# Altium project LKS074DO_BRUSH_0406.PrjPcb
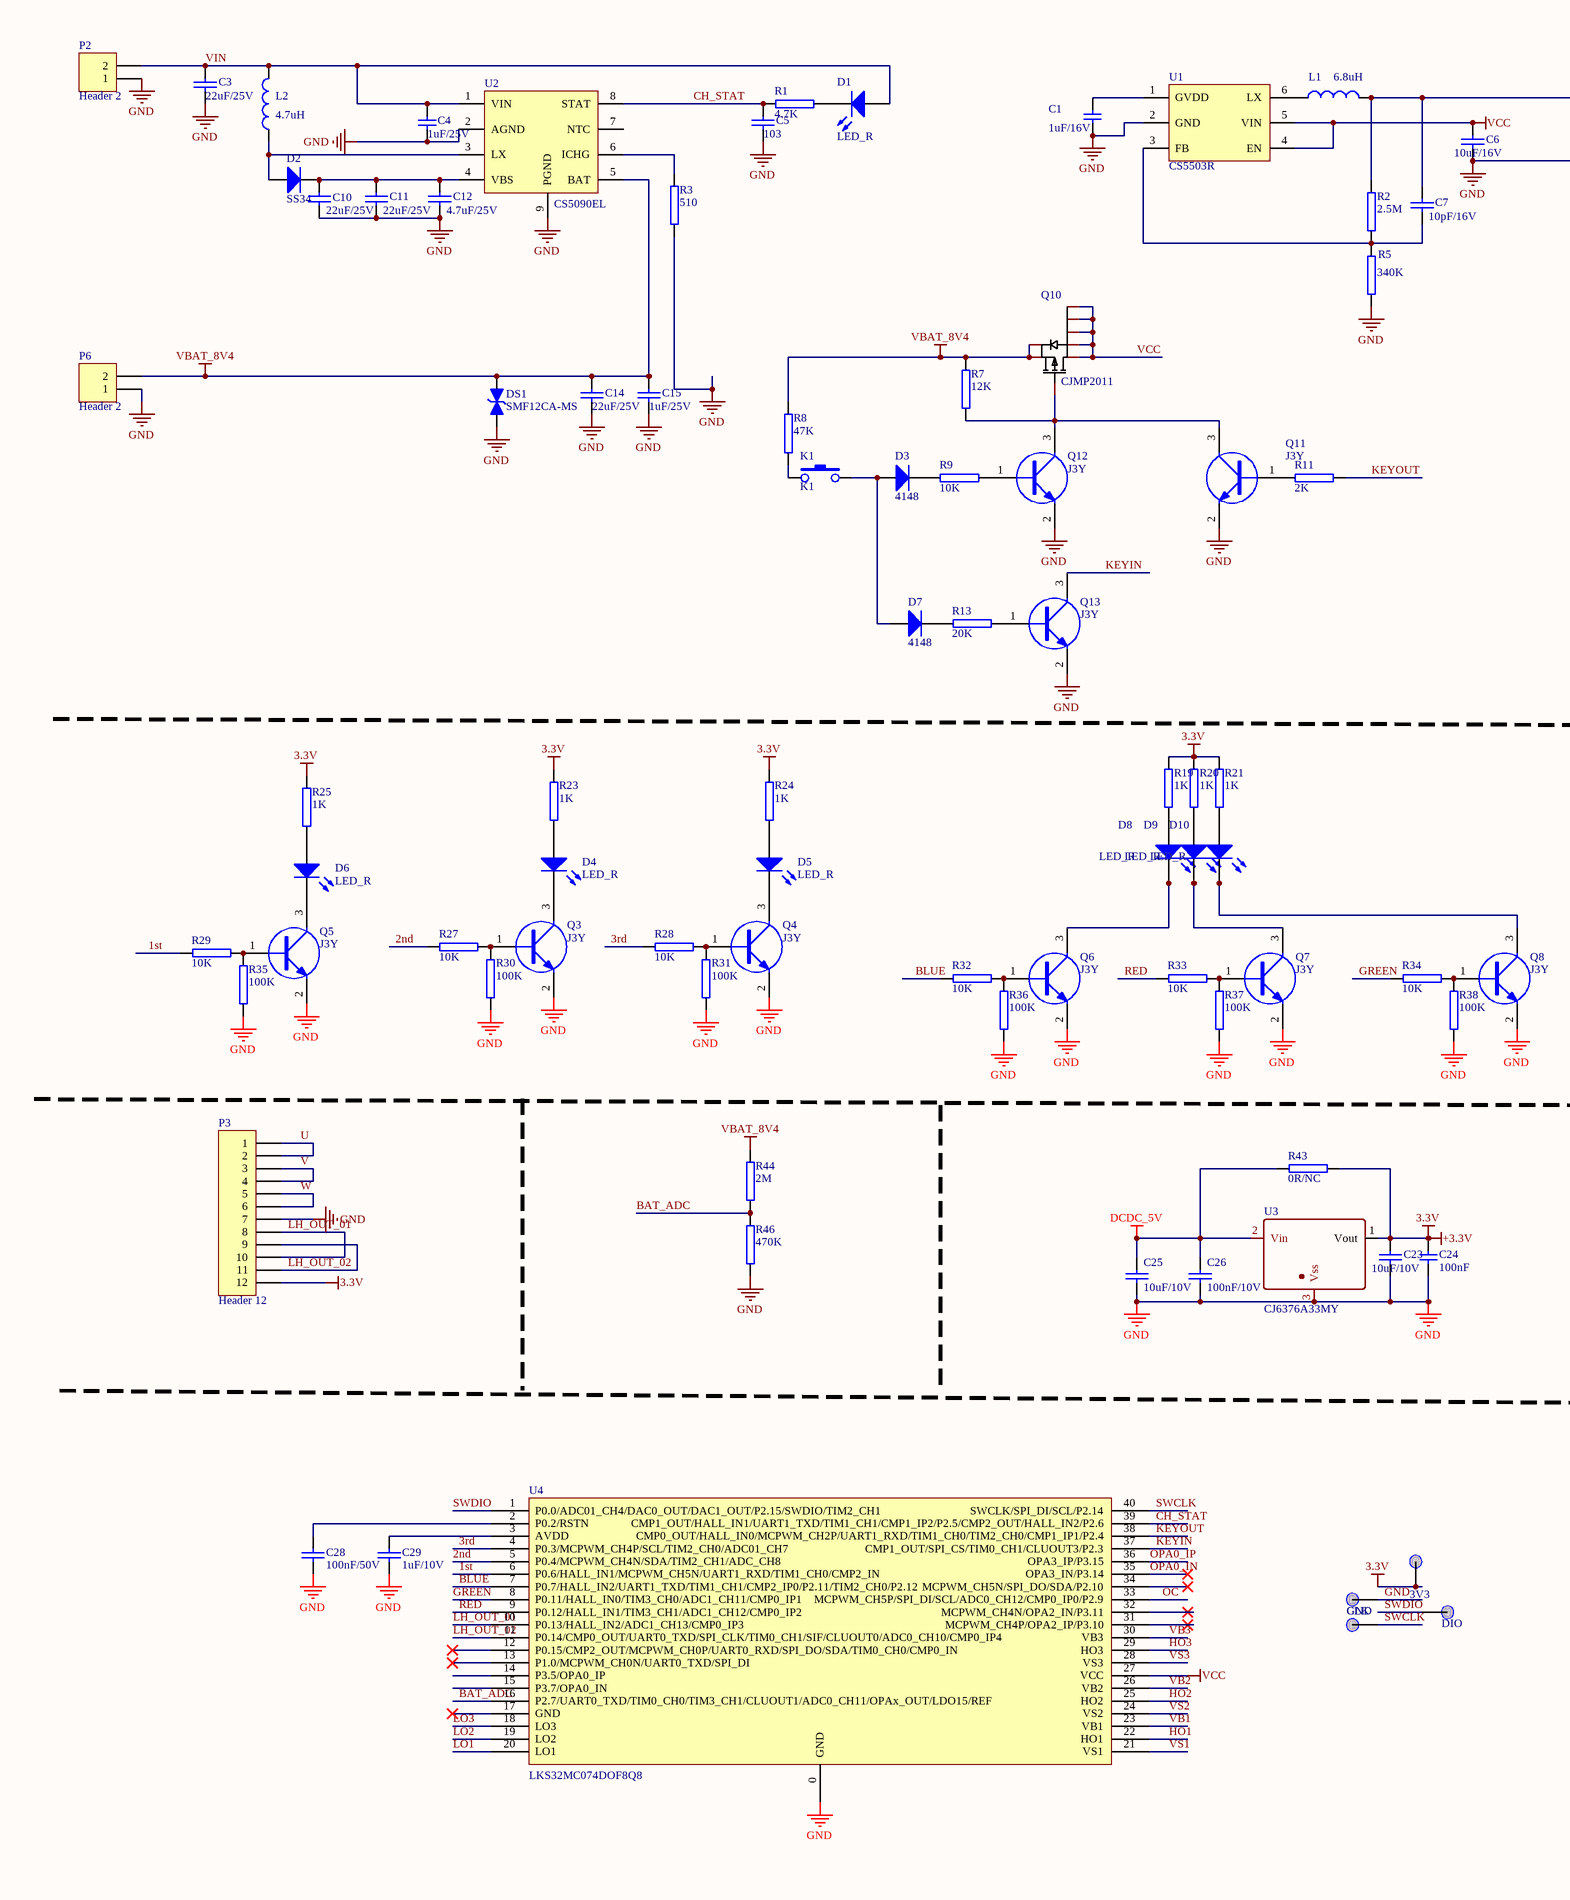
[diagram p0: LKS_074DO_0406.SchDoc, left]
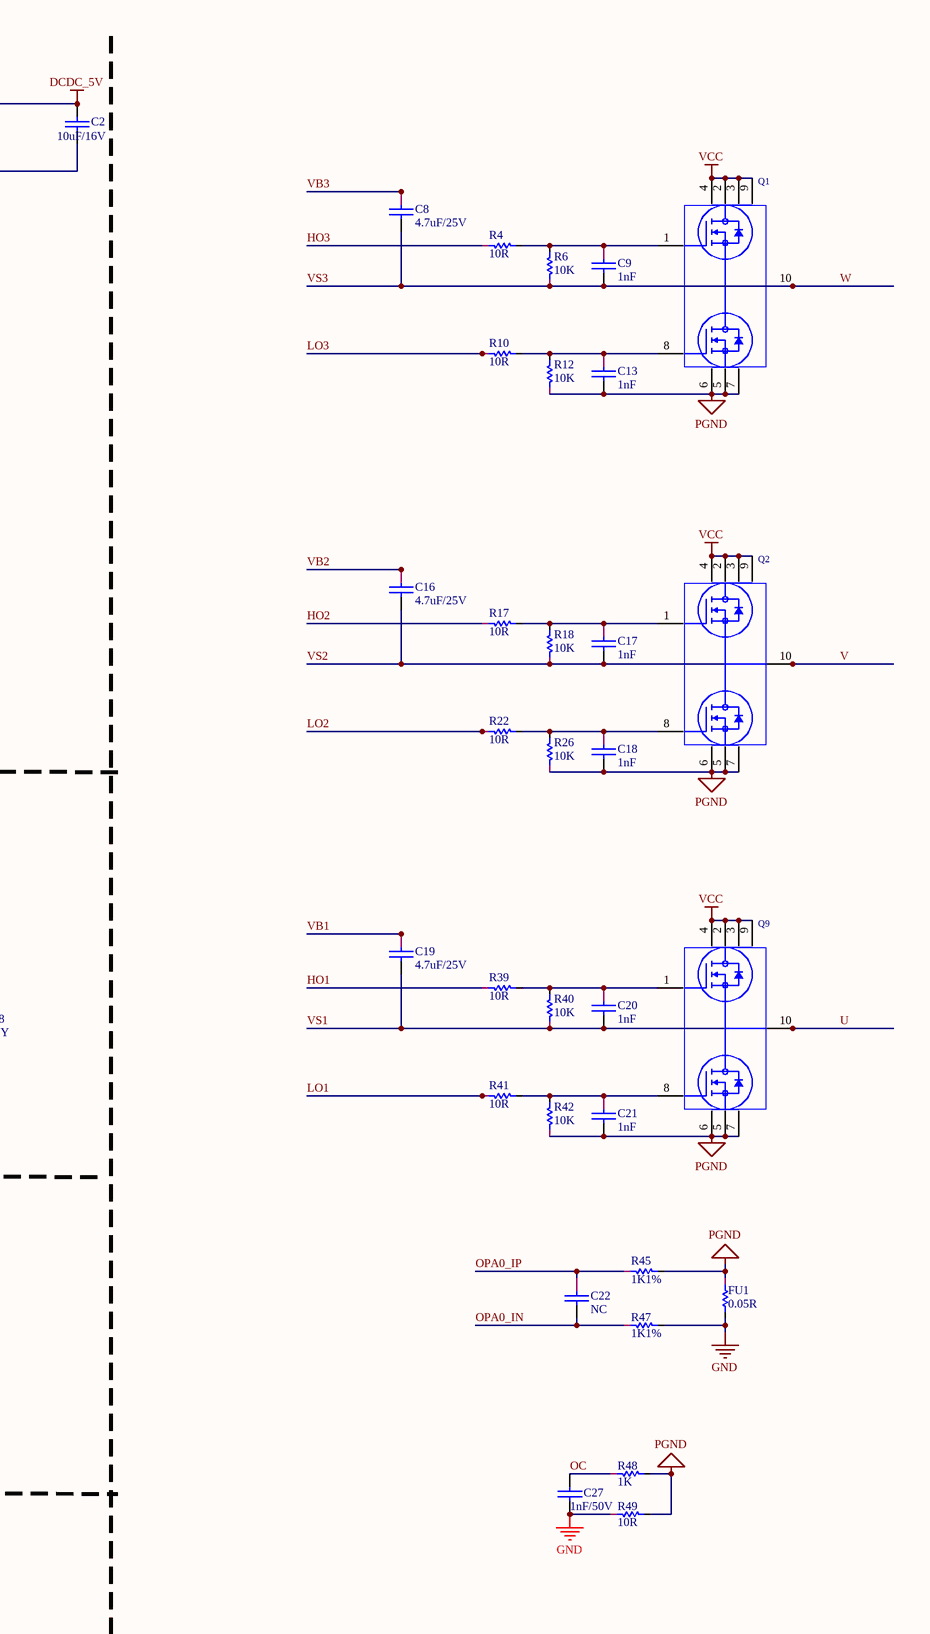
[diagram p1: LKS_074DO_0406.SchDoc, right]
1 sheet, 114 parts. Net scope: global (net labels, ports and power ports of the same name join across sheets).
Board file: LKS_Motor_0406.PcbDoc

## Sheet LKS_074DO_0406.SchDoc: LKS034DO_FOC_MOTOR
size C; Date: 20220518; DrawnBy: WPJ; Organization: PuXun Tech Co.Ltd.; Revision: V1.0; SheetNumber: 1; SheetTotal: 1; PageSetup: Record=PageOptions?CenterHorizontal=True?CenterVertical=True?PrintScale=0.54?XCorrection=1.00?YCorrection=1.00?PrintKind=0?BorderSize=5000000?LeftOffset=0?BottomOffset=0?Orientation=2?PaperLength=1000?PaperWidth=1000?Scale=100?PaperSource=7?PrintQuality=-4?MediaType=1?DitherType=10?PaperKind=A4?PrintScaleMode=1

### Parts
3V3  test  [piot]  (value not drawn)
C1  1uF/16V  [C 0402_M]
C2  10uF/16V  [C 0603_M]
C3  22uF/25V  [C 0603_M]
C4  1uF/25V  [C 0402_M]
C5  103  [R 0402_M]
C6  10uF/16V  [C 0603_M]
C7  10pF/16V  [C 0402_M]
C8  4.7uF/25V  [C 0402_M]
C9  1nF  [C 0402_M]
C10  22uF/25V  [C 0603_M]
C11  22uF/25V  [C 0603_M]
C12  4.7uF/25V  [C 0402_M]
C13  1nF  [C 0402_M]
C14  22uF/25V  [C 0603_M]
C15  1uF/25V  [C 0402_M]
C16  4.7uF/25V  [C 0402_M]
C17  1nF  [C 0402_M]
C18  1nF  [C 0402_M]
C19  4.7uF/25V  [C 0402_M]
C20  1nF  [C 0402_M]
C21  1nF  [C 0402_M]
C22  NC  [C 0402_M]
C23  10uF/10V  [C 0603_M]
C24  100nF  [C 0402_M]
C25  10uF/10V  [C 0603_M]
C26  100nF/10V  [C 0402_M]
C27  1nF/50V  [C 0402_M]
C28  100nF/50V  [C 0402_M]
C29  1uF/10V  [C 0402_M]
CLK  test  [piot]  (value not drawn)
D1  LED_R  [0603-LED]
D2  SS34  [SOD123FL]
D3  4148  [SOD-323]
D4  LED_R  [0603-LED]
D5  LED_R  [0603-LED]
D6  LED_R  [0603-LED]
D7  4148  [SOD-323]
D8  LED_R  [0603-LED]
D9  LED_R  [0603-LED]
D10  LED_R  [0603-LED]
DIO  test  [piot]  (value not drawn)
DS1  SMF12CA-MS  [SOD-123F]
FU1  0.05R  [R 0805_M]
GND  test  [piot]  (value not drawn)
K1  K1  [SMD3.3X3.3X2]
L1  6.8uH  [SMD3.5X3 .2- duplicate]
L2  4.7uH  [SMD3.5X3 .2- duplicate]
P2  Header 2  [CONN_SMD_2P_0.6]
P3  Header 12  [SMD-12]
P6  Header 2  [CONN_SMD_2P_0.6]
Q1  CJBM3020  [DFN-3X3_8]  (value not drawn)
Q2  CJBM3020  [DFN-3X3_8]  (value not drawn)
Q3  J3Y  [SOT-23]
Q4  J3Y  [SOT-23]
Q5  J3Y  [SOT-23]
Q6  J3Y  [SOT-23]
Q7  J3Y  [SOT-23]
Q8  J3Y  [SOT-23]
Q9  CJBM3020  [DFN-3X3_8]  (value not drawn)
Q10  CJMP2011  [DFN-6-2X2]
Q11  J3Y  [SOT-23]
Q12  J3Y  [SOT-23]
Q13  J3Y  [SOT-23]
R1  4.7K  [C 0402_M]
R2  2.5M  [C 0402_M]
R3  510  [R 0402_M]
R4  10R  [R 0402_M]
R5  340K  [C 0402_M]
R6  10K  [R 0402_M]
R7  12K  [C 0402_M]
R8  47K  [C 0402_M]
R9  10K  [C 0402_M]
R10  10R  [R 0402_M]
R11  2K  [C 0402_M]
R12  10K  [R 0402_M]
R13  20K  [C 0402_M]
R17  10R  [R 0402_M]
R18  10K  [R 0402_M]
R19  1K  [C 0402_M]
R20  1K  [C 0402_M]
R21  1K  [C 0402_M]
R22  10R  [R 0402_M]
R23  1K  [C 0402_M]
R24  1K  [C 0402_M]
R25  1K  [C 0402_M]
R26  10K  [R 0402_M]
R27  10K  [C 0402_M]
R28  10K  [C 0402_M]
R29  10K  [C 0402_M]
R30  100K  [C 0402_M]
R31  100K  [C 0402_M]
R32  10K  [C 0402_M]
R33  10K  [C 0402_M]
R34  10K  [C 0402_M]
R35  100K  [C 0402_M]
R36  100K  [C 0402_M]
R37  100K  [C 0402_M]
R38  100K  [C 0402_M]
R39  10R  [R 0402_M]
R40  10K  [R 0402_M]
R41  10R  [R 0402_M]
R42  10K  [R 0402_M]
R43  0R/NC  [0603]
R44  2M  [C 0402_M]
R45  1K1%  [R 0402_M]
R46  470K  [C 0402_M]
R47  1K1%  [R 0402_M]
R48  1K  [R 0402_M]
R49  10R  [R 0402_M]
U1  CS5503R  [SOT23-6L]
U2  CS5090EL  [DFN2X2_8_0.5]
U3  CJ6376A33MY  [SOT-23]
U4  LKS32MC074DOF8Q8  [QFN40]

### Nets
+3.3V: 3V3.1 C23.2 C24.1 P3.12 R19.2 R20.2 R21.2 R23.2 R24.2 R25.2 R43.2 U3.1(Vout)  [also labelled 3.3V]
DCDC_5V: C2.2 C7.2 C25.2 C26.1 L1.2 R2.1 R43.1 U3.2(Vin)
GND: C1.1 C2.1 C3.1 C4.2 C5.1 C6.1 C10.1 C11.1 C12.1 C14.1 C15.1 C23.1 C24.2 C25.1 C26.2 C27.1 C28.2 C29.1 DS1.2(K) FU1.1 GND.1 P2.1 P3.7 P6.1 Q3.2(E) Q4.2(E) Q5.2(E) Q6.2(E) Q7.2(E) Q8.2(E) Q11.2(E) Q12.2(E) Q13.2(E) R3.2 R5.2 R30.2 R31.2 R35.2 R36.2 R37.2 R38.2 R46.2 R47.1 R49.2 U1.2(GND) U2.2(AGND) U2.9(PGND) U3.3(Vss) U4.0(GND)
PGND: C13.1 C18.1 C21.1 FU1.2 Q1.5(S2) Q1.6(S2) Q1.7(S2) Q2.5(S2) Q2.6(S2) Q2.7(S2) Q9.5(S2) Q9.6(S2) Q9.7(S2) R12.2 R26.2 R42.2 R45.1 R48.1 R49.1
VBAT_8V4: C14.2 C15.2 DS1.1(A) P6.2 Q10.4(S) Q10.8(S) R7.2 R8.2 R44.1 U2.5(BAT)
VCC: C6.2 Q1.2(D1) Q1.3(D1) Q1.4(D1) Q1.9(D1) Q2.2(D1) Q2.3(D1) Q2.4(D1) Q2.9(D1) Q9.2(D1) Q9.3(D1) Q9.4(D1) Q9.9(D1) Q10.1(D) Q10.2(D) Q10.5(D) Q10.6(D) Q10.7(D) U1.4(EN) U1.5(VIN) U4.27(VCC)
1st: R29.2 U4.6(P0.6/HALL_IN1/MCPWM_CH5N/UART1_RXD/TIM1_CH0/CMP2_IN)
2nd: R27.2 U4.5(P0.4/MCPWM_CH4N/SDA/TIM2_CH1/ADC_CH8)
3rd: R28.2 U4.4(P0.3/MCPWM_CH4P/SCL/TIM2_CH0/ADC01_CH7)
BAT_ADC: R44.2 R46.1 U4.16(P2.7/UART0_TXD/TIM0_CH0/TIM3_CH1/CLUOUT1/ADC0_CH11/OPAx_OUT/LDO15/REF)
BLUE: R32.2 U4.7(P0.7/HALL_IN2/UART1_TXD/TIM1_CH1/CMP2_IP0/P2.11/TIM2_CH0/P2.12)
CH_STAT: C5.2 R1.1 U2.8(STAT) U4.39(CMP1_OUT/HALL_IN1/UART1_TXD/TIM1_CH1/CMP1_IP2/P2.5/CMP2_OUT/HALL_IN2/P2.6)
GREEN: R34.2 U4.8(P0.11/HALL_IN0/TIM3_CH0/ADC1_CH11/CMP0_IP1)
HO1: R39.2 U4.22(HO1)
HO2: R17.2 U4.25(HO2)
HO3: R4.2 U4.29(HO3)
KEYIN: Q13.3(C) U4.37(CMP1_OUT/SPI_CS/TIM0_CH1/CLUOUT3/P2.3)
KEYOUT: R11.2 U4.38(CMP0_OUT/HALL_IN0/MCPWM_CH2P/UART1_RXD/TIM1_CH0/TIM2_CH0/CMP1_IP1/P2.4)
LH_OUT_01: P3.8 P3.10 U4.10(P0.13/HALL_IN2/ADC1_CH13/CMP0_IP3)
LH_OUT_02: P3.9 P3.11 U4.11(P0.14/CMP0_OUT/UART0_TXD/SPI_CLK/TIM0_CH1/SIF/CLUOUT0/ADC0_CH10/CMP0_IP4)
LO1: R41.2 U4.20(LO1)
LO2: R22.2 U4.19(LO2)
LO3: R10.2 U4.18(LO3)
OC: C27.2 R48.2 U4.33(MCPWM_CH5P/SPI_DI/SCL/ADC0_CH12/CMP0_IP0/P2.9)
OPA0_IN: C22.1 R47.2 U4.35(OPA3_IN/P3.14)
OPA0_IP: C22.2 R45.2 U4.36(OPA3_IP/P3.15)
RED: R33.2 U4.9(P0.12/HALL_IN1/TIM3_CH1/ADC1_CH12/CMP0_IP2)
SWCLK: CLK.1 U4.40(SWCLK/SPI_DI/SCL/P2.14)
SWDIO: DIO.1 U4.1(P0.0/ADC01_CH4/DAC0_OUT/DAC1_OUT/P2.15/SWDIO/TIM2_CH1)
U: C19.1 C20.1 P3.1 P3.2 Q9.10(S1/D2) R40.2 U4.21(VS1)  [also labelled VS1]
V: C16.1 C17.1 P3.3 P3.4 Q2.10(S1/D2) R18.2 U4.24(VS2)  [also labelled VS2]
VB1: C19.2 U4.23(VB1)
VB2: C16.2 U4.26(VB2)
VB3: C8.2 U4.30(VB3)
VIN: C3.2 C4.1 D1.1(A) L2.2 P2.2 U2.1(VIN)
VS3: C8.1 C9.1 P3.5 P3.6 Q1.10(S1/D2) R6.2 U4.28(VS3)  [also labelled W]
NetC1_2: C1.2 U1.1(GVDD)
NetC7_1: C7.1 R2.2 R5.1 U1.3(FB)
NetC9_2: C9.2 Q1.1(G1) R4.1 R6.1
NetC10_2: C10.2 C11.2 C12.2 D2.2(K) U2.4(VBS)
NetC13_2: C13.2 Q1.8(G2) R10.1 R12.1
NetC17_2: C17.2 Q2.1(G1) R17.1 R18.1
NetC18_2: C18.2 Q2.8(G2) R22.1 R26.1
NetC20_2: C20.2 Q9.1(G1) R39.1 R40.1
NetC21_2: C21.2 Q9.8(G2) R41.1 R42.1
NetC28_1: C28.1 U4.2(P0.2/RSTN)
NetC29_2: C29.2 U4.3(AVDD)
NetD1_2: D1.2(K) R1.2
NetD2_1: D2.1(A) L2.1 U2.3(LX)
NetD3_1: D3.1(A) D7.1(A) K1.2
NetD3_2: D3.2(K) R9.1
NetD4_1: D4.1(A) R23.1
NetD4_2: D4.2(K) Q3.3(C)
NetD5_1: D5.1(A) R24.1
NetD5_2: D5.2(K) Q4.3(C)
NetD6_1: D6.1(A) R25.1
NetD6_2: D6.2(K) Q5.3(C)
NetD7_2: D7.2(K) R13.1
NetD8_1: D8.1(A) R19.1
NetD8_2: D8.2(K) Q6.3(C)
NetD9_1: D9.1(A) R20.1
NetD9_2: D9.2(K) Q7.3(C)
NetD10_1: D10.1(A) R21.1
NetD10_2: D10.2(K) Q8.3(C)
NetK1_1: K1.1 R8.1
NetL1_1: L1.1 U1.6(LX)
NetQ3_1: Q3.1(B) R27.1 R30.1
NetQ4_1: Q4.1(B) R28.1 R31.1
NetQ5_1: Q5.1(B) R29.1 R35.1
NetQ6_1: Q6.1(B) R32.1 R36.1
NetQ7_1: Q7.1(B) R33.1 R37.1
NetQ8_1: Q8.1(B) R34.1 R38.1
NetQ10_3: Q10.3(G) Q11.3(C) Q12.3(C) R7.1
NetQ11_1: Q11.1(B) R11.1
NetQ12_1: Q12.1(B) R9.2
NetQ13_1: Q13.1(B) R13.2
NetR3_1: R3.1 U2.6(ICHG)

Not connected (* = marked no-connect by the designer): U2 7(NTC); U4 12(P0.15/CMP2_OUT/MCPWM_CH0P/UART0_RXD/SPI_DO/SDA/TIM0_CH0/CMP0_IN)* 13(P1.0/MCPWM_CH0N/UART0_TXD/SPI_DI)* 14(P3.5/OPA0_IP) 15(P3.7/OPA0_IN) 17(GND)* 31(MCPWM_CH4P/OPA2_IP/P3.10)* 32(MCPWM_CH4N/OPA2_IN/P3.11)* 34(MCPWM_CH5N/SPI_DO/SDA/P2.10)*

### Notes on the sheet
- TITLE：
- SIEZ：C
- VERSION：
- V1.0
- DESIGNER：
- COMPANY：
- DATE：

### Library data of the parts
C1 C4 C24 = CAP
C2 C3 C5-C23 C25 C26 = CAP: Capacitor
C27-C29 = C: Capacitor
D1 D4-D6 D8-D10 = LED
D2 D3 D7 = Diode: Default Diode; Published: 8-Jun-2000; LatestRevisionDate: 17-Jul-2002; LatestRevisionNote: Re-released for DXP Platform.; PackageDocument: Sep-1996; PackageReference: SMC; Publisher: Altium Limited; Code_JEDEC: DO-214-AB
DS1 = DIODE-3: 12V/19.9V
FU1 R4 R6 R10 R12 R17 R18 R22 R26 R39-R42 R45 R47-R49 = RAS
L1 L2 = Inductor: Code_IEC: 1005; Published: 8-Jun-2000; LatestRevisionDate: 17-Jul-2002; LatestRevisionNote: Re-released for DXP Platform.; PackageReference: 0402-A; Publisher: Altium Limited; Code_JEITA: 0402
P2 P6 = Header 2: Header, 2-Pin; LatestRevisionDate: 17-Jul-2002; LatestRevisionNote: Re-released for DXP Platform.; Publisher: Altium Limited
P3 = Header 12: Header, 12-Pin; LatestRevisionDate: 17-Jul-2002; LatestRevisionNote: Re-released for DXP Platform.; Publisher: Altium Limited
Q3-Q8 Q11-Q13 = NPN: NPN Transistor
R1-R3 R5 R7-R9 R11 R13 R19-R21 R23-R25 R27-R38 R43 R44 R46 = RES2_S
U3 = 78L15
U4 = LKS32MC074DF8Q8: 芯片
Q1 Q2 Q9 = CJBM3020: PCB DECAL: DFN-3X3_8